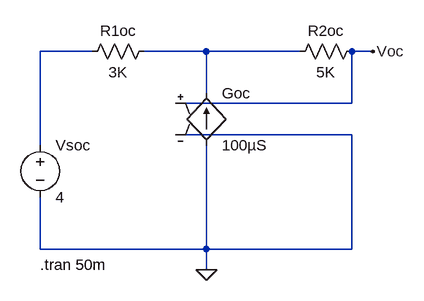
[diagram p0: schematic circuitOC.asc]
circuitOC.asc, the LTspice schematic file:
Version 4
SHEET 1 984 680
WIRE 192 -16 112 -16
WIRE 368 -16 272 -16
WIRE 512 -16 368 -16
WIRE 624 -16 592 -16
WIRE 368 48 368 -16
WIRE 592 64 592 -16
WIRE 592 64 320 64
WIRE 592 112 320 112
WIRE 112 128 112 -16
WIRE 112 288 112 208
WIRE 368 288 368 128
WIRE 368 288 112 288
WIRE 592 288 592 112
WIRE 592 288 368 288
WIRE 368 320 368 288
FLAG 368 320 0
FLAG 624 -16 Voc
SYMBOL res 288 -32 R90
WINDOW 0 0 56 VBottom 2
WINDOW 3 32 56 VTop 2
SYMATTR InstName R1oc
SYMATTR Value 3K
SYMBOL g 368 32 R0
SYMATTR InstName Goc
SYMATTR Value 100µS
SYMBOL res 608 -32 R90
WINDOW 0 0 56 VBottom 2
WINDOW 3 32 56 VTop 2
SYMATTR InstName R2oc
SYMATTR Value 5K
SYMBOL voltage 112 112 R0
SYMATTR InstName Vsoc
SYMATTR Value 4
TEXT 112 312 Left 2 !.tran 50m

The netlist it stands for:
* circuitOC.asc
R1oc N002 N001 3K
Goc 0 N002 Voc 0 100µS
R2oc Voc N002 5K
Vsoc N001 0 4
.tran 50m
.backanno
.end